# Altium project HLK-W806-KIT-V1.2.PrjPcb
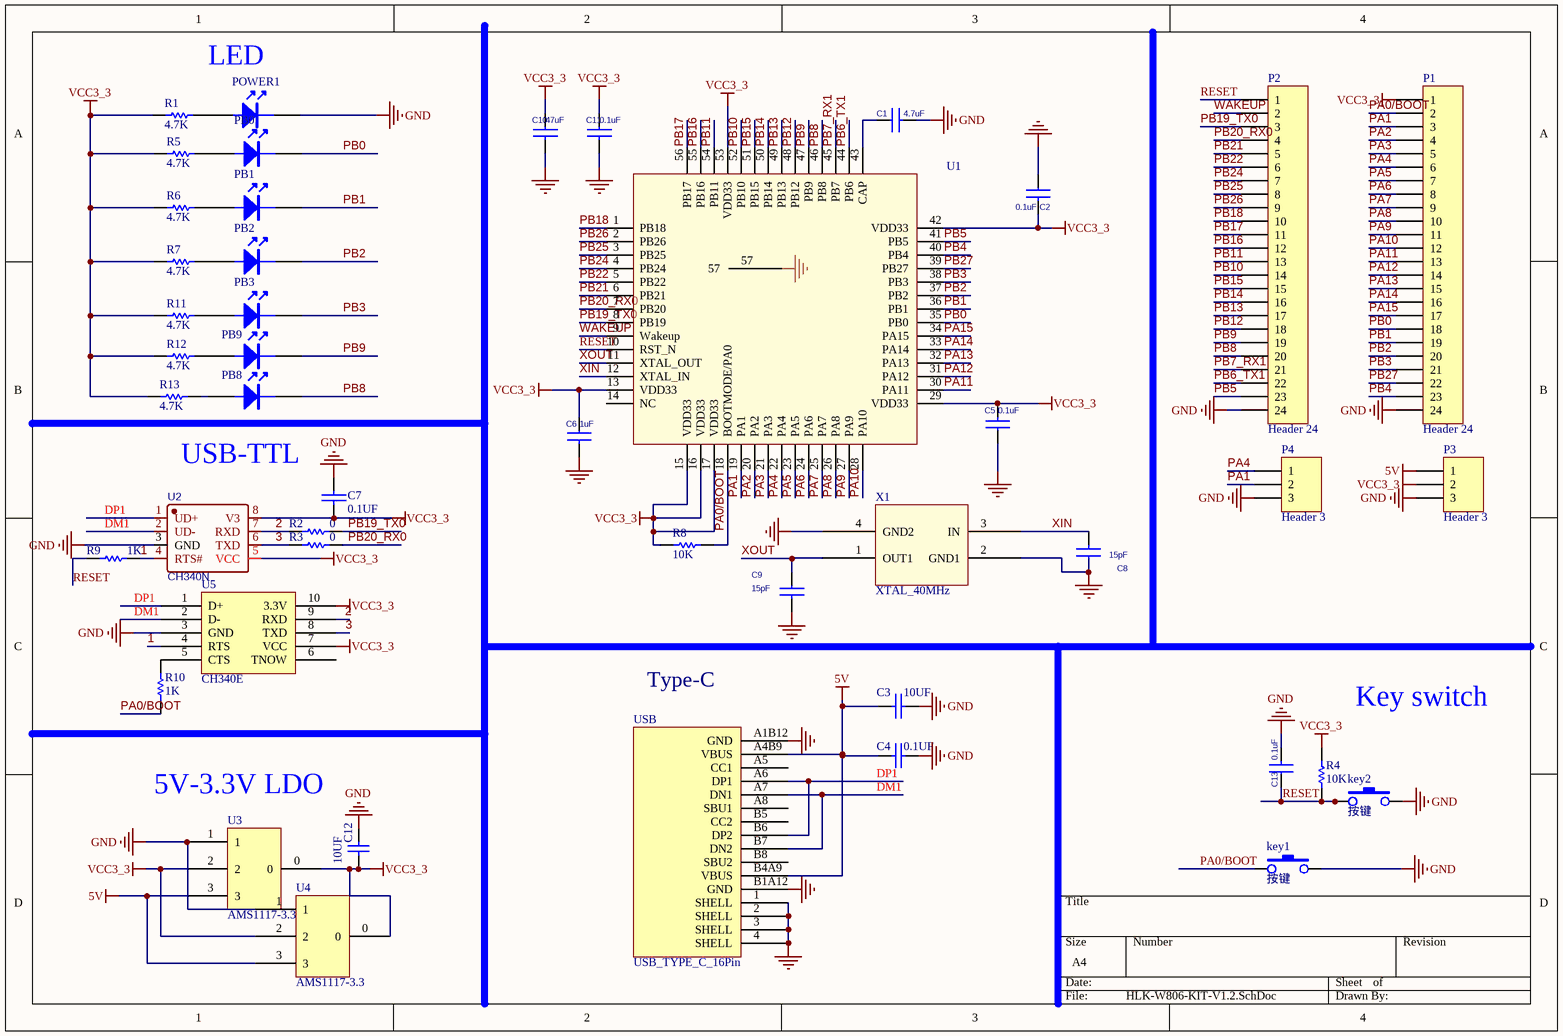
[diagram p0: HLK-W806-KIT-V1.2.SchDoc]
1 sheet, 46 parts. Net scope: global (net labels, ports and power ports of the same name join across sheets).
Board file: HLK-W806-KIT-V1.2.PcbDoc

## Sheet HLK-W806-KIT-V1.2.SchDoc
size A4

### Parts
C1  4.7uF  [0603]
C2  0.1uF  [0603]
C3  10UF  [0603_1]
C4  0.1UF  [0603_1]
C5  0.1uF  [0603]
C6  1uF  [0603]
C7  0.1UF  [0603_1]
C8  15pF  [0603]
C9  15pF  [0603]
C10  47uF  [R0805]
C11  0.1uF  [0603]
C12  10UF  [0603_1]
C13  0.1uF  [0603]
key1  按键  [正按小龟]
key2  按键  [正按小龟]
P1  Header 24  [HDR1X24]
P2  Header 24  [HDR1X24]
P3  Header 3  [HDR1X3]
P4  Header 3  [HDR1X3]
PB0  (no value)  [0603LED]
PB1  (no value)  [0603LED]
PB2  (no value)  [0603LED]
PB3  (no value)  [0603LED]
PB8  (no value)  [0603LED]
PB9  (no value)  [0603LED]
POWER1  (no value)  [0603LED]
R1  4.7K  [0603_1]
R2  0  [0603_1]
R3  0  [0603_1]
R4  10K  [0603_1]
R5  4.7K  [0603_1]
R6  4.7K  [0603_1]
R7  4.7K  [0603_1]
R8  10K  [0603_1]
R9  1K  [0603_1]
R10  1K  [R 0603_L]
R11  4.7K  [0603_1]
R12  4.7K  [0603_1]
R13  4.7K  [0603_1]
U1  Component_1  [QFN-56]  (value not drawn)
U2  CH340N  [SOP8]
U3  AMS1117-3.3  [AMS1117]
U4  AMS1117-3.3  [SOT223]
U5  CH340E  [MSOP10_L]
USB  USB_TYPE_C_16Pin  [USB-C-16PIN-1]
X1  XTAL_40MHz  [SMD-3225]

### Nets
5V: C3.2 C4.2 P3.1 U3.3 U4.3 USB.A4B9(VBUS) USB.B4A9(VBUS)
GND: C1.2 C2.1 C3.1 C4.1 C5.1 C6.2 C7.1 C8.1 C9.2 C10.2 C11.2 C12.1 C13.2 key1.2 key2.2 P1.24 P2.24 P3.3 P4.3 POWER1.2 U1.57 U2.3(GND) U3.1 U4.1 U5.3(GND) USB.1(SHELL) USB.2(SHELL) USB.3(SHELL) USB.4(SHELL) USB.A1B12(GND) USB.B1A12(GND) X1.2(GND1) X1.4(GND2)
VCC3_3: C2.2 C5.2 C6.1 C7.2 C10.1 C11.1 C12.2 P1.1 P3.2 R1.1 R4.2 R5.1 R6.1 R7.1 R8.1 R11.1 R12.1 R13.1 U1.13(VDD33) U1.15(VDD33) U1.16(VDD33) U1.17(VDD33) U1.29(VDD33) U1.42(VDD33) U1.53(VDD33) U2.5(VCC) U2.8(V3) U3.0 U3.2 U4.0 U4.2 U5.7(VCC) U5.10(3.3V)
1: R9.2 U2.4(RTS#) U5.4(RTS)
2: R2.1 U2.7(RXD) U5.9(RXD)
3: R3.1 U2.6(TXD) U5.8(TXD)
DM1: U2.2(UD-) U5.2(D-) USB.A7(DN1) USB.B7(DN2)
DP1: U2.1(UD+) U5.1(D+) USB.A6(DP1) USB.B6(DP2)
PA0/BOOT: key1.1 P1.2 R8.2 R10.1 U1.18(BOOTMODE/PA0)
PA1: P1.3 P4.2 U1.19(PA1)
PA2: P1.4 U1.20(PA2)
PA3: P1.5 U1.21(PA3)
PA4: P1.6 P4.1 U1.22(PA4)
PA5: P1.7 U1.23(PA5)
PA6: P1.8 U1.24(PA6)
PA7: P1.9 U1.25(PA7)
PA8: P1.10 U1.26(PA8)
PA9: P1.11 U1.27(PA9)
PA10: P1.12 U1.28(PA10)
PA11: P1.13 U1.30(PA11)
PA12: P1.14 U1.31(PA12)
PA13: P1.15 U1.32(PA13)
PA14: P1.16 U1.33(PA14)
PA15: P1.17 U1.34(PA15)
PB0: P1.18 PB0.2 U1.35(PB0)
PB1: P1.19 PB1.2 U1.36(PB1)
PB2: P1.20 PB2.2 U1.37(PB2)
PB3: P1.21 PB3.2 U1.38(PB3)
PB4: P1.23 U1.40(PB4)
PB5: P2.23 U1.41(PB5)
PB6_TX1: P2.22 U1.44(PB6)
PB7_RX1: P2.21 U1.45(PB7)
PB8: P2.20 PB8.2 U1.46(PB8)
PB9: P2.19 PB9.2 U1.47(PB9)
PB10: P2.14 U1.52(PB10)
PB11: P2.13 U1.54(PB11)
PB12: P2.18 U1.48(PB12)
PB13: P2.17 U1.49(PB13)
PB14: P2.16 U1.50(PB14)
PB15: P2.15 U1.51(PB15)
PB16: P2.12 U1.55(PB16)
PB17: P2.11 U1.56(PB17)
PB18: P2.10 U1.1(PB18)
PB19_TX0: P2.3 R2.2 U1.8(PB19)
PB20_RX0: P2.4 R3.2 U1.7(PB20)
PB21: P2.5 U1.6(PB21)
PB22: P2.6 U1.5(PB22)
PB24: P2.7 U1.4(PB24)
PB25: P2.8 U1.3(PB25)
PB26: P2.9 U1.2(PB26)
PB27: P1.22 U1.39(PB27)
RESET: C13.1 key2.1 P2.1 R4.1 R9.1 U1.10(RST_N)
WAKEUP: P2.2 U1.9(Wakeup)
XIN: C8.2 U1.12(XTAL_IN) X1.3(IN)
XOUT: C9.1 U1.11(XTAL_OUT) X1.1(OUT1)
NetC1_1: C1.1 U1.43(CAP)
NetPB0_1: PB0.1 R5.2
NetPB1_1: PB1.1 R6.2
NetPB2_1: PB2.1 R7.2
NetPB3_1: PB3.1 R11.2
NetPB8_1: PB8.1 R13.2
NetPB9_1: PB9.1 R12.2
NetPOWER1_1: POWER1.1 R1.2
NetR10_2: R10.2 U5.5(CTS)

Not connected (* = marked no-connect by the designer): U1 14(NC); U5 6(TNOW); USB A5(CC1) A8(SBU1) B5(CC2) B8(SBU2)

### Notes on the sheet
- LED
- USB-TTL
- Type-C
- Key switch
- 5V-3.3V LDO

### Library data of the parts
C1 C2 C5 C6 C8-C11 C13 = CAP NP_Dup1
C3 C4 C7 = CAP: Capacitor
C12 = Cap: Capacitor; Value: 100pF; Published: 8-Jun-2000; LatestRevisionDate: 17-Jul-2002; LatestRevisionNote: Re-released for DXP Platform.; PackageReference: RAD-0.3; Publisher: Altium Limited
P1 P2 = Header 24: Header, 24-Pin; LatestRevisionDate: 17-Jul-2002; LatestRevisionNote: Re-released for DXP Platform.; Publisher: Altium Limited
P3 P4 = Header 3: Header, 3-Pin; LatestRevisionDate: 17-Jul-2002; LatestRevisionNote: Re-released for DXP Platform.; Publisher: Altium Limited
PB0-PB3 PB8 PB9 POWER1 = LED
R1-R13 = Res1: Resistor; Published: 8-Jun-2000; LatestRevisionDate: 17-Jul-2002; LatestRevisionNote: Re-released for DXP Platform.; PackageReference: AXIAL-0.3; Publisher: Altium Limited
  R1 R5-R7 R11-R13: Value: 4.7K
  R2 R3: Value: 0
  R4 R8: Value: 10K
  R9 R10: Value: 1K
U2 = CH340N: BOM_Manufacturer: WCH(Jiangsu Qin Heng); Contributor: LCSC; BOM_Supplier: LCSC; BOM_Supplier Part: C506813; BOM_Manufacturer Part: CH340N; BOM_JLCPCB Part Class: Extended Part; spicePre: U; spiceSymbolName: CH340N
U3 U4 = Component_1